# EAGLE design Active Probe Proto2 (EAGLE 6.5.0)
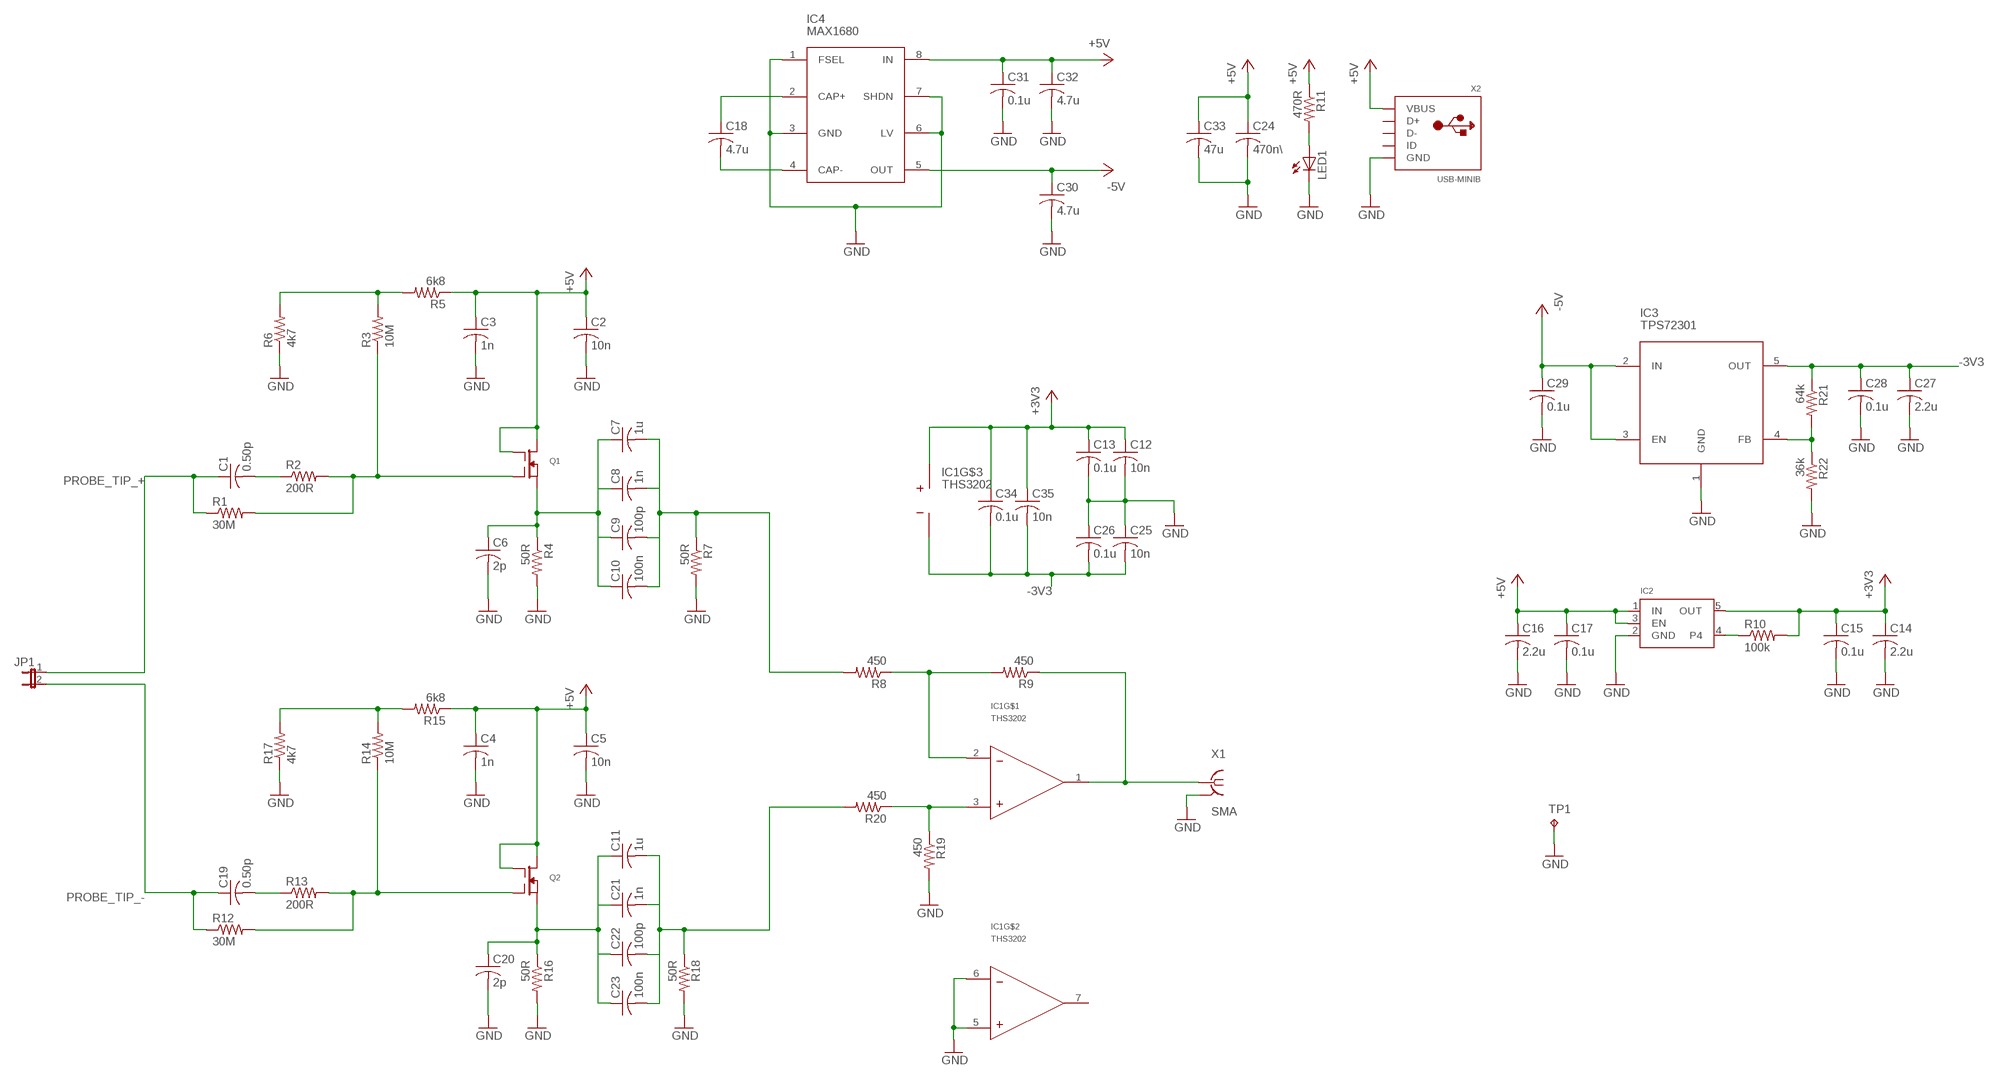
[diagram p0: schematic, sheet 1]

## Parts
C1  0.50p  C-USC0603  [C0603]
C2  10n  C-USC0603  [C0603]
C3  1n  C-USC0603  [C0603]
C4  1n  C-USC0603  [C0603]
C5  10n  C-USC0603  [C0603]
C6  2p  C-USC0603  [C0603]
C7  1u  C-USC0603  [C0603]
C8  1n  C-USC0603  [C0603]
C9  100p  C-USC0603  [C0603]
C10  100n  C-USC0603  [C0603]
C11  1u  C-USC0603  [C0603]
C12  10n  C-USC0603  [C0603]
C13  0.1u  C-USC0603  [C0603]
C14  2.2u  C-USC0603  [C0603]
C15  0.1u  C-USC0603  [C0603]
C16  2.2u  C-USC0603  [C0603]
C17  0.1u  C-USC0603  [C0603]
C18  4.7u  C-USC0603  [C0603]
C19  0.50p  C-USC0603  [C0603]
C20  2p  C-USC0603  [C0603]
C21  1n  C-USC0603  [C0603]
C22  100p  C-USC0603  [C0603]
C23  100n  C-USC0603  [C0603]
C24  470n\  C-USC0603  [C0603]
C25  10n  C-USC0603  [C0603]
C26  0.1u  C-USC0603  [C0603]
C27  2.2u  C-USC0603  [C0603]
C28  0.1u  C-USC0603  [C0603]
C29  0.1u  C-USC0603  [C0603]
C30  4.7u  C-USC0603  [C0603]
C31  0.1u  C-USC0603  [C0603]
C32  4.7u  C-USC0603  [C0603]
C33  47u  C-USC1206  [C1206]
C34  0.1u  C-USC0603  [C0603]
C35  10n  C-USC0603  [C0603]
IC1  THS3202  [SOIC8]
IC2  VREG_SOT23-5  [SOT23-5]
IC3  TPS72301  [SOT23-5L]
IC4  MAX1680  MAX1680/1  [SO8]
JP1  HEADER_SIDE_2POS  [HEADER_SIDE_2POS]
LED1  LED3MM  [LED3MM]
Q1  BF998  [SOT143B]
Q2  BF998  [SOT143B]
R1  30M  R-US_R0603  [R0603]
R2  200R  R-US_R0603  [R0603]
R3  10M  R-US_R0603  [R0603]
R4  50R  R-US_R0603  [R0603]
R5  6k8  R-US_R0603  [R0603]
R6  4k7  R-US_R0603  [R0603]
R7  50R  R-US_R0603  [R0603]
R8  450  R-US_R0603  [R0603]
R9  450  R-US_R0603  [R0603]
R10  100k  R-US_R0603  [R0603]
R11  470R  R-US_R0805  [R0805]
R12  30M  R-US_R0603  [R0603]
R13  200R  R-US_R0603  [R0603]
R14  10M  R-US_R0603  [R0603]
R15  6k8  R-US_R0603  [R0603]
R16  50R  R-US_R0603  [R0603]
R17  4k7  R-US_R0603  [R0603]
R18  50R  R-US_R0603  [R0603]
R19  450  R-US_R0603  [R0603]
R20  450  R-US_R0603  [R0603]
R21  64k  R-US_R0603  [R0603]
R22  36k  R-US_R0603  [R0603]
TP1  TPTP20SQ  [TP20SQ]
X1  SMA  SMA-142-0701-801/806  [J502-ND-142-0701-801/806]
X2  USB-MINIB  USBMINIB  [USB-MINIB]

## Nets
+3V3: C12.1 C13.1 C14.1 C15.1 C34.1 C35.1 IC1.8(VCC) IC2.5(OUT) R10.2
+5V: C2.1 C3.1 C4.1 C5.1 C16.1 C17.1 C24.1 C31.1 C32.1 C33.1 IC2.1(IN) IC2.3(EN) IC4.8(IN) Q1.2(D) Q1.3(G2) Q2.2(D) Q2.3(G2) R5.1 R11.1 R15.1 X2.VBUS
-3V3: C25.2 C26.2 C27.1 C28.1 C34.2 C35.2 IC1.4(GND) IC3.5(OUT) R21.1
-5V: C29.1 C30.1 IC3.2(IN) IC3.3(EN) IC4.5(OUT)
GND: C2.2 C3.2 C4.2 C5.2 C6.2 C12.2 C13.2 C14.2 C15.2 C16.2 C17.2 C20.2 C24.2 C25.1 C26.1 C27.2 C28.2 C29.2 C30.2 C31.2 C32.2 C33.2 IC1.5(IN+) IC1.6(IN-) IC2.2(GND) IC3.1(GND) IC4.1(FSEL) IC4.3(GND) IC4.6(LV) IC4.7(SHDN) LED1.K(C) R4.2 R6.1 R7.2 R16.2 R17.1 R18.2 R19.2 R22.2 TP1.TP X1.G@1(GND) X2.GND
N$1: R14.2 R15.2 R17.2
N$2: C6.1 C7.1 C8.1 C9.1 C10.1 Q1.1(S) R4.1
N$3: R3.2 R5.2 R6.2
N$4: IC2.4 R10.1
N$5: C7.2 C8.2 C9.2 C10.2 R7.1 R8.2
N$6: Q1.4(G1) R1.2 R2.2 R3.1
N$7: C11.2 C21.2 C22.2 C23.2 R18.1 R20.2
N$8: Q2.4(G1) R12.2 R13.2 R14.1
N$9: C11.1 C20.1 C21.1 C22.1 C23.1 Q2.1(S) R16.1
N$11: LED1.A R11.2
N$12: C19.2 R13.1
N$13: IC1.1(OUT) R9.1 X1.1
N$14: C18.2 IC4.4(CAP-)
N$15: C18.1 IC4.2(CAP+)
N$16: IC1.3(IN+) R19.1 R20.1
N$17: IC1.2(IN-) R8.1 R9.2
N$18: C1.2 R2.1
N$19: IC3.4(FB) R21.2 R22.1
PROBE_TIP_+: C1.1 JP1.1 R1.1
PROBE_TIP_-: C19.1 JP1.2 R12.1
Unconnected: IC1.7(OUT) X2.D+ X2.D- X2.ID

## Power pins joined to a net without a drawn wire
GND: X1.G@2(GND) X1.G@3(GND) X1.G@4(GND)

## Library data of the parts
C1-C35 = rcl:C-US: CAPACITOR, American symbol
IC1 = Kramnik's Library:THS3202
IC2 = microbuilder:VREG_SOT23-5: SOT23-5 Fixed Voltage Regulators To better organise some of the SOT23-5 fixed voltage regulators in this library, this new part was created. Part Current Out V Out V In V Dropout Digikey Part No. ADP121 150mA 3.3V 3.4-5.5V 0.09V @ 150mA ADP121-AUJZ33R7CT-ND ADP121 150mA 3.0V 3.1-5.5V 0.09V @ 150mA ADP121-AUJZ30R7CT-ND ADP122 300mA 3.3V 3.4-5.5V 0.085V @ 300mA ADP122AUJZ-3.3-R7CT-ND ADP1712 300mA 3.3V 3.5-5.5V 0.17V @ 300mA ADP1712AUJZ-3.3-R7TR-ND AP7311 (Low Cost) 150mA 3.3V 3.5-6V 0.15V @ 150mA AP7311-33WG-7DICT-ND LD39015M18R 150mA 1.8V 1.9V-5.5V 0.08V @ 100mA 497-6977-1-ND MCP1824T-3302E/OT 300mA 3.3V 3.5V-6V 0.2V @ 300mA MCP1824T-3302E/OTCT-ND MIC5205-2.5YM5 TR 150mA 2.5V 2.7-16V 0.165V @ 150mA 576-1257-2-ND MIC5205-3.0YM5 TR 150mA 3.0V 3.2V-16V 0.165V @ 150mA 576-1258-2-ND MIC5205-3.3YM5 TR 150mA 3.3V 3.5V-16V 0.165V @ 150mA 576-1259-2-ND TPS780330220 150mA 3.3V+2.2V 3.6-5.5V 250mV Max 296-23332-1-ND TDA3663/N1,135 100mA 3.3V 3.5-45V 0.18V @ 50mA 568-5343-1-ND
IC3 = Kramnik's Library:TPS72301
IC4 = Kramnik's Library:MAX1680/1: 125mA, Frequency-Selectable, Switched-Capacitor Voltage Converter Digikey: http://www.digikey.com/product-detail/en/MAX1681ESA%2B/MAX1681ESA%2B-ND/947772
JP1 = Kramnik's Library:HEADER_SIDE_2POS
LED1 = led:LED: LED OSRAM: - CHIPLED LG R971, LG N971, LY N971, LG Q971, LY Q971, LO R971, LY R971 LH N974, LH R974 LS Q976, LO Q976, LY Q976 LO Q996 - Hyper CHIPLED LW Q18S LB Q993, LB Q99A, LB R99A - SideLED LS A670, LO A670, LY A670, LG A670, LP A670 LB A673, LV A673, LT A673, LW A673 LH A674 LY A675 LS A676, LA A676, LO A676, LY A676, LW A676 LS A679, LY A679, LG A679 - Hyper Micro SIDELED® LS Y876, LA Y876, LO Y876, LY Y876 LT Y87S - SmartLED LW L88C, LW L88S LB L89C, LB L89S, LG L890 LS L89K, LO L89K, LY L89K LS L896, LA L896, LO L896, LY L896 - TOPLED LS T670, LO T670, LY T670, LG T670, LP T670 LSG T670, LSP T670, LSY T670, LOP T670, LYG T670 LG T671, LOG T671, LSG T671 LB T673, LV T673, LT T673, LW T673 LH T674 LS T676, LA T676, LO T676, LY T676, LB T676, LH T676, LSB T676, LW T676 LB T67C, LV T67C, LT T67C, LS T67K, LO T67K, LY T67K, LW E67C LS E67B, LA E67B, LO E67B, LY E67B, LB E67C, LV E67C, LT E67C LW T67C LS T679, LY T679, LG T679 LS T770, LO T770, LY T770, LG T770, LP T770 LB T773, LV T773, LT T773, LW T773 LH T774 LS E675, LA E675, LY E675, LS T675 LS T776, LA T776, LO T776, LY T776, LB T776 LHGB T686 LT T68C, LB T68C - Hyper Mini TOPLED® LB M676 - Mini TOPLED Santana® LG M470 LS M47K, LO M47K, LY M47K Source: http://www.osram.convergy.de LUXEON: - LUMILED® LXK2-PW12-R00, LXK2-PW12-S00, LXK2-PW14-U00, LXK2-PW14-V00 LXK2-PM12-R00, LXK2-PM12-S00, LXK2-PM14-U00 LXK2-PE12-Q00, LXK2-PE12-R00, LXK2-PE12-S00, LXK2-PE14-T00, LXK2-PE14-U00 LXK2-PB12-K00, LXK2-PB12-L00, LXK2-PB12-M00, LXK2-PB14-N00, LXK2-PB14-P00, LXK2-PB14-Q00 LXK2-PR12-L00, LXK2-PR12-M00, LXK2-PR14-Q00, LXK2-PR14-R00 LXK2-PD12-Q00, LXK2-PD12-R00, LXK2-PD12-S00 LXK2-PH12-R00, LXK2-PH12-S00 LXK2-PL12-P00, LXK2-PL12-Q00, LXK2-PL12-R00 Source: www.luxeon.com KINGBRIGHT: KA-3528ASYC Source: www.kingbright.com
Q1 Q2 = Kramnik's Library:BF998
R1-R22 = resistor:R-US_: RESISTOR, American symbol
TP1 = testpad:TP: Test pad
X1 = con-coax:SMA-: SMA 50 Ohm End Launch Jack Receptacle - Round Contact Johnson Components Source: www.johnsoncomponents.com .. J502-ND.pdf; MF: JOHNSON COMPONENTS; MPN: 142-0701-801; OC_FARNELL: 1608592; OC_NEWARK: 90F2624
X2 = adafruit:USB: USB Connectors USBMINIB - Surface Mount Female Mini-B USB Connector 4UConnector: 06564 By microbuilder.eu Thru-hole RA Female Mini-B USB Connector 4UConnector: 18732 By ladyada.net

## Board
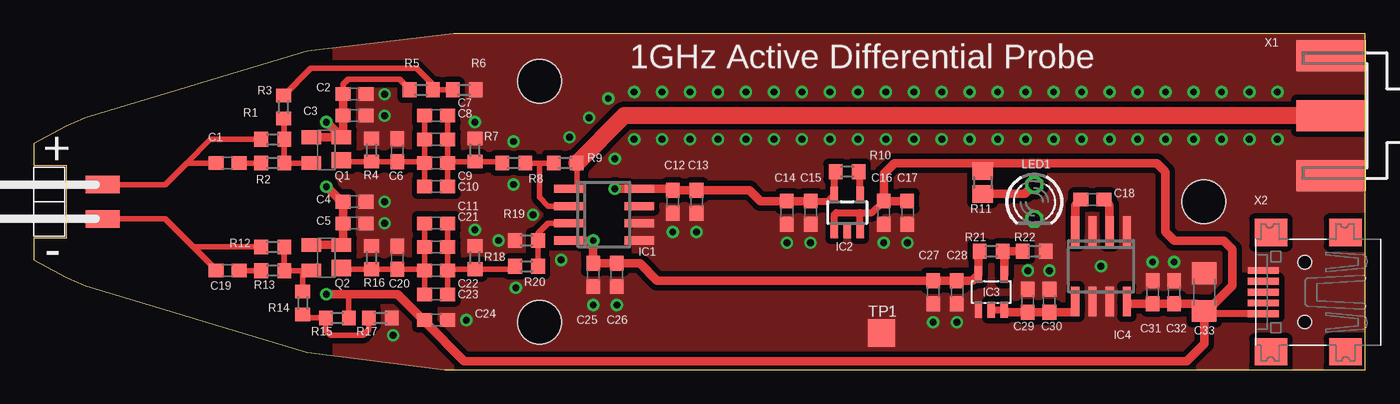
[diagram p1: board, top side]
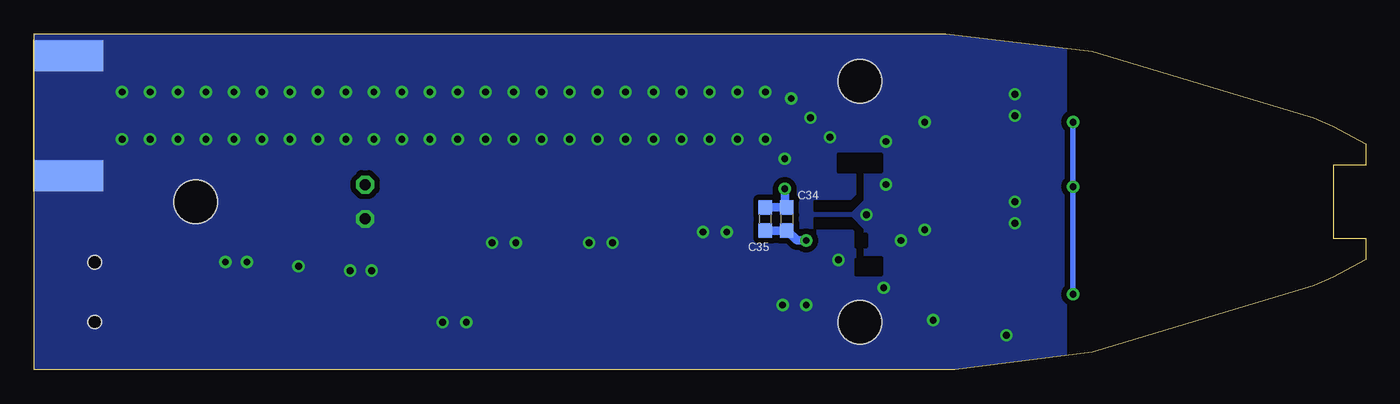
[diagram p2: board, bottom side, seen from below]

Size 98.27 x 24.77 mm. Coordinates in mm from the lower left corner, seen from the top.
Outline: 20.16,1.27 30.32,0 98.25,0 98.25,24.77 30.96,24.77 20.16,23.5 3.81,18.57 2.38,17.94 0,16.67 0,15.08 2.38,15.08 2.38,9.68 0,9.68 0,8.1 2.38,6.83 3.81,6.19 20.16,1.27
Copper layers (1*16): Top 0.035mm / dielectric 1.5mm / Bottom 0.035mm
Design rules: minimum track width 10mil, minimum drill 24mil, track to track 16mil, track to pad 16mil, pad to pad 16mil, via to via 16mil, smd to smd 1mil, copper to edge 1mil, drill to drill 8mil, minimum pad ring 10mil, minimum via ring 8mil, stop-mask expansion 4mil, vias tented up to drill 0mil, thermal gap 10mil
Holes 3.2 mm at 86.33,12.38 37.31,21.27 37.31,3.49
tRestrict: area 40.2,8.9 to 44,14
bRestrict: area 35.7,11.7 to 40.6,15.9; area 35.7,7 to 40.6,11.1

### Footprints (pad centres in the part's own frame; a part is rotated, then mirrored left to right if it is on the bottom)
C0603 = smd 1.1 x 1: 1 -0.85,0; 2 0.85,0
C1206 = smd 1.6 x 1.8: 1 -1.4,0; 2 1.4,0
SOIC8 = smd 0.6 x 2.2: 1 -1.905,-2.6; 2 -0.635,-2.6; 3 0.635,-2.6; 4 1.905,-2.6; 5 1.905,2.6; 6 0.635,2.6; 7 -0.635,2.6; 8 -1.905,2.6
SOT23-5 = smd 0.55 x 1.2: 1 -0.95,-1.3; 2 0,-1.3; 3 0.95,-1.3; 4 0.95,1.3; 5 -0.95,1.3
SOT23-5L = smd 0.55 x 1.2: 1 -0.95,-1.3; 2 0,-1.3; 3 0.95,-1.3; 4 0.95,1.3; 5 -0.95,1.3
SO8 = smd 0.6 x 2.2: 1 -1.905,-2.6; 2 -0.635,-2.6; 3 0.635,-2.6; 4 1.905,-2.6; 5 1.905,2.6; 6 0.635,2.6; 7 -0.635,2.6; 8 -1.905,2.6
HEADER_SIDE_2POS = smd 2.54 x 1.27: 1 5.08,3.81; 2 5.08,1.27
LED3MM = drill 0.813 octagon: A -1.27,0; K 1.27,0
SOT143B = smd 1.2 x 1.44: 1 -0.75,-1.1 | smd 1 x 1.44: 2 0.95,-1.1; 3 0.95,1.1; 4 -0.95,1.1
R0603 = smd 1 x 1.1: 1 -0.85,0; 2 0.85,0
R0805 = smd 1.3 x 1.5: 1 -0.85,0; 2 0.85,0
TP20SQ = smd 2 x 2: TP 0,0
J502-ND-142-0701-801/806 = smd 5.08 x 2.286: 1 2.565,0; G@1 2.565,4.42; G@2 2.565,-4.42 | smd 5.08 x 2.286 bottom: G@3 2.565,4.42; G@4 2.565,-4.42
USB-MINIB = smd 0.5 x 2.308: D+ 0,4.064; D- -0.8,4.064; GND 1.6,4.064; ID 0.8,4.064; VBUS -1.6,4.064 | smd 2 x 2.4: GND1 -4.4,-2; GND2 -4.4,3.5; GND3 4.4,3.5; GND4 4.4,-2 | hole 1: -2.2,1; 2.2,1

### Placement (x,y rotation side)
C1  14.29,15.24 0 top
C2  23.65,20.32 0 top
C3  23.65,18.73 0 top
C4  23.65,12.38 0 top
C5  23.65,10.79 0 top
C6  26.83,16.19 90 top
C7  29.69,18.73 0 top
C8  29.69,16.99 0 top
C9  29.69,15.24 0 top
C10  29.69,13.49 0 top
C11  29.69,10.79 0 top
C12  47.15,12.38 270 top
C13  48.89,12.38 270 top
C14  55.56,11.59 270 top
C15  57.31,11.59 270 top
C16  62.71,11.59 270 top
C17  64.45,11.59 270 top
C18  78.11,12.54 180 top
C19  14.29,7.3 0 top
C20  26.83,8.26 90 top
C21  29.69,9.05 0 top
C22  29.69,7.3 0 top
C23  29.69,5.56 0 top
C24  29.69,3.65 0 top
C25  41.27,6.99 90 top
C26  43.02,6.99 90 top
C27  66.36,5.71 270 top
C28  68.1,5.71 270 top
C29  73.34,5.08 90 top
C30  74.93,5.08 90 top
C31  82.55,5.71 90 top
C32  84.14,5.71 90 top
C33  86.36,5.71 90 top
C34  42.7,11.11 270 bottom
C35  44.29,11.11 270 bottom
IC1  42.07,11.43 270 top
IC2  60.01,11.59 0 top
IC3  70.64,5.71 0 top
IC4  78.74,7.62 180 top
JP1  0,9.84 0 top
LED1  73.82,12.38 270 top
Q1  21.59,16.19 90 top
Q2  21.59,8.26 90 top
R1  17.62,16.99 0 top
R2  17.62,15.24 0 top
R3  18.42,19.37 90 top
R4  24.92,16.19 90 top
R5  28.58,20.64 0 top
R6  31.75,20.64 180 top
R7  32.54,16.19 90 top
R8  35.4,15.24 180 top
R9  39.21,15.24 180 top
R10  60.01,14.61 180 top
R11  70.01,13.81 270 top
R12  17.62,9.05 0 top
R13  17.62,7.3 0 top
R14  19.84,4.92 270 top
R15  22.38,3.81 180 top
R16  24.92,8.26 90 top
R17  25.56,3.81 180 top
R18  32.54,8.26 90 top
R19  36.35,9.53 180 top
R20  36.35,7.62 180 top
R21  70.64,8.73 0 top
R22  73.82,8.73 0 top
TP1  62.55,2.7 0 top
X1  98.27,18.73 180 top
X2  94.77,5.71 90 top

### Tracks (layer width: path | path; a pad name or v marks a point on that pad's centre or on a via)
+3V3  (via drill 0.5)
  Top 0.508: C15.1 58.61,12.44 IC2.5 59.06,14.51 R10.2
  Top 0.61: v42.86,13.34 IC1.8 47.05,13.34 C12.1 C13.1 52.81,13.23 53.6,12.44 C14.1 C15.1
  Bottom 0.61: C35.1 C34.1 42.86,12.12 v42.86,13.34
+5V  (via drill 0.5)
  Top 0.254: 22.86,9.21 Q2.2
  Top 0.406: R15.1 23.23,5.5 23.18,5.56 | C24.1 28.84,3.6 28.81,3.57 | R5.1 27.73,20.69 26.99,21.43 23.18,21.43 22.8,21.06 C2.1
  Top 0.508: X2.VBUS 86.56,4.12 C33.1 | IC2.1 59.06,11.43 59.21,11.59 60.96,11.59 | IC2.3 60.96,11.59 | 60.96,11.59 61.85,11.59 C16.1
  Top 0.61: Q2.3 Q2.2 22.8,9.32 C5.1 C4.1 22.7,12.38 v21.59,13.49 | Q1.3 Q1.2 | Q1.2 22.8,17.26 C3.1 C2.1 | IC4.8 80.8,4.87 C31.1 C32.1 85.81,4.87 C33.1 86.36,4.13 | C17.1 C16.1 62.71,14.45 63.5,15.24 70.01,15.24 | v21.59,18.26 21.59,18.24 Q1.2 | 86.36,4.13 86.36,1.91 85.09,0.64 31.75,0.64 28.81,3.57 26.83,5.56 23.18,5.56 v21.59,5.56 | 70.01,15.24 82.87,15.24 83.5,14.61 83.5,10.16 84.14,9.53 87.79,9.53 88.42,8.89 88.42,6.19 86.36,4.13 | R11.1 70.01,15.24
  Bottom 0.406: v21.59,18.26 v21.59,13.49 v21.59,5.56
-3V3  (via drill 0.5)
  Top 0.61: IC1.4 v41.28,9.53 C25.2 C26.2 44.71,7.83 45.98,6.57 C27.1 C28.1 69.24,6.57 IC3.5 69.69,8.63 R21.1
  Bottom 0.508: v41.28,9.53
  Bottom 0.61: C35.2 C34.2 41.97,9.53 v41.28,9.53
-5V
  Top 0.508: IC3.2 IC3.3
  Top 0.61: IC3.3 71.78,4.23 C29.1 C30.1 76.62,4.23 76.84,4.45 IC4.5
GND  (via drill 0.5)
  other vias: 91.76,20.48 91.76,16.99 78.74,7.62 25.88,18.73 82.55,7.94 47.15,10.16 48.89,10.16 43.02,4.76 41.27,4.76 74.93,7.3 89.69,16.99 89.69,20.48 87.63,20.48 87.63,16.99 85.57,16.99 85.57,20.48 83.5,20.48 83.5,16.99 81.44,16.99 81.44,20.48 79.38,20.48 79.38,16.99 77.31,16.99 77.31,20.48 75.25,16.99 75.25,20.48 73.18,20.48 73.18,16.99 71.12,16.99 71.12,20.48 69.06,20.48 69.06,16.99 66.99,16.99 66.99,20.48 64.93,20.48 64.93,16.99 62.87,16.99 62.87,20.48 60.8,20.48 60.8,16.99 58.74,16.99 58.74,20.48 56.67,20.48 56.67,16.99 54.61,16.99 54.61,20.48 52.55,20.48 52.55,16.99 50.48,16.99 50.48,20.48 48.42,16.99 48.42,20.48 46.35,20.48 46.35,16.99 44.29,16.99 44.29,20.48 42.39,20 40.96,18.57 39.53,17.14 42.86,15.56 25.88,20.32 25.88,10.79 25.88,12.38 84.14,7.94 73.34,7.3 68.1,3.49 66.36,3.49 55.56,9.37 57.31,9.37 62.71,9.37 64.45,9.37 38.89,8.1 36.83,11.43 34.29,9.53 32.54,10.32 32.54,18.26 26.51,2.54 31.91,3.65 35.4,16.83 35.4,13.65 35.56,6.03
  pour Top (no thermals): 98.9,28.57 22.22,28.89 22.22,-3.81 98.9,-3.49
  pour Bottom (no thermals): 98.9,28.26 98.9,-3.17 22.22,-3.81 22.22,28.26
N$1
  Top 0.406: R17.2 24.71,2.96 24.29,2.54 21.91,2.54 21.53,2.91 R15.2 20.11,3.81 R14.2
N$2
  Top 0.406: Q1.1 22.79,15.34 R4.1 C6.1 28.73,15.34 C9.1 | C9.1 C8.1 C7.1 | C10.1 C9.1
N$3
  Top 0.406: R6.2 R5.2 29.43,21.06 28.26,22.23 20.42,22.23 R3.2
N$4
  Top 0.508: IC2.4 60.96,14.51 R10.1
N$5
  Top 0.406: C9.2 C8.2 C7.2 | C9.2 30.64,15.34 R7.1 34.45,15.34 R8.2 | C10.2 C9.2
N$6
  Top 0.406: Q1.4 R2.2 R1.2 18.47,18.46 R3.1
N$7
  Top 0.406: C22.2 C21.2 C11.2 | C22.2 30.64,7.41 R18.1 35.29,7.41 R20.2 | C23.2 C22.2
N$8
  Top 0.406: R12.2 R13.2 19.84,7.3 | 19.84,7.3 Q2.4 | R14.1 19.84,7.3
N$9
  Top 0.406: Q2.1 22.79,7.41 R16.1 C20.1 28.73,7.41 C22.1 | C22.1 C21.1 C11.1 | C23.1 C22.1
N$11
  Top 0.61: R11.2 73.13,12.96 LED1.A
N$12
  Top 0.406: R13.1 C19.2
N$13
  Top 0.406: R9.1 40.06,13.34 IC1.1
  Top 1.27: X1.1 43.55,18.73 R9.1
N$14
  Top 0.61: IC4.4 76.84,12.12 C18.2
N$15
  Top 0.61: IC4.2 79.38,12.12 C18.1
N$16
  Top 0.406: IC1.3 37.94,10.79 37.2,10.06 R19.1 R20.1
N$17
  Top 0.406: R9.2 37.31,15.24 | 37.31,15.24 R8.1 | IC1.2 37.94,12.06 37.31,12.7 37.31,15.24
N$18
  Top 0.406: R2.1 C1.2
N$19
  Top 0.61: R22.1 R21.2 71.59,8.63 IC3.4
PROBE_TIP_+
  Top 0.406: R1.1 13.02,16.99 11.27,15.24 | 11.27,15.24 C1.1 | JP1.1 9.68,13.65 11.27,15.24
PROBE_TIP_-
  Top 0.406: JP1.2 9.68,11.11 11.67,9.13 11.75,9.05 | C19.1 13.44,7.36 11.75,9.05 | R12.1 11.75,9.05

### Text on the board
tNames: 1GHz Active Differential Probe | + | -